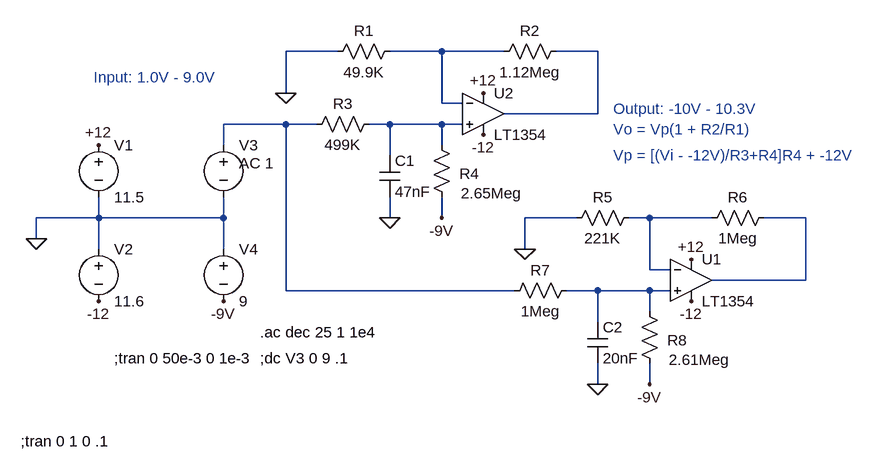
[diagram p0: schematic VCO Pickoff.asc]
VCO Pickoff.asc, the LTspice schematic file:
Version 4
SHEET 1 1120 680
WIRE 272 -112 192 -112
WIRE 432 -112 352 -112
WIRE 528 -112 432 -112
WIRE 672 -112 608 -112
WIRE 192 -48 192 -112
WIRE 432 -32 432 -112
WIRE 464 -32 432 -32
WIRE 672 -16 672 -112
WIRE 672 -16 528 -16
WIRE 192 0 96 0
WIRE 240 0 192 0
WIRE 352 0 320 0
WIRE 432 0 352 0
WIRE 464 0 432 0
WIRE 96 32 96 0
WIRE 432 32 432 0
WIRE 352 48 352 0
WIRE -96 144 -96 112
WIRE -96 144 -192 144
WIRE 96 144 96 112
WIRE 96 144 -96 144
WIRE 352 144 352 112
WIRE 432 144 432 112
WIRE 640 144 560 144
WIRE 752 144 720 144
WIRE 848 144 752 144
WIRE 992 144 928 144
WIRE -192 176 -192 144
WIRE -96 192 -96 144
WIRE 96 192 96 144
WIRE 560 192 560 144
WIRE 752 224 752 144
WIRE 784 224 752 224
WIRE 992 240 992 144
WIRE 992 240 848 240
WIRE 192 256 192 0
WIRE 544 256 192 256
WIRE 672 256 624 256
WIRE 752 256 672 256
WIRE 784 256 752 256
WIRE 752 288 752 256
WIRE 672 304 672 256
WIRE 672 400 672 368
WIRE 752 400 752 368
FLAG -192 176 0
FLAG -96 32 +12
FLAG -96 272 -12
FLAG 192 -48 0
FLAG 496 -48 +12
FLAG 496 16 -12
FLAG 96 272 -9V
FLAG 432 144 -9V
FLAG 560 192 0
FLAG 816 208 +12
FLAG 816 272 -12
FLAG 752 400 -9V
FLAG 352 144 0
FLAG 672 400 0
SYMBOL voltage -96 16 R0
WINDOW 123 0 0 Left 0
WINDOW 39 0 0 Left 0
SYMATTR InstName V1
SYMATTR Value 11.5
SYMBOL voltage -96 176 R0
WINDOW 123 0 0 Left 0
WINDOW 39 0 0 Left 0
SYMATTR InstName V2
SYMATTR Value 11.6
SYMBOL res 368 -128 R90
WINDOW 0 0 56 VBottom 2
WINDOW 3 32 56 VTop 2
SYMATTR InstName R1
SYMATTR Value 49.9K
SYMBOL res 624 -128 R90
WINDOW 0 0 56 VBottom 2
WINDOW 3 32 56 VTop 2
SYMATTR InstName R2
SYMATTR Value 1.12Meg
SYMBOL voltage 96 16 R0
WINDOW 3 -105 105 Invisible 2
WINDOW 123 24 44 Left 2
SYMATTR Value PULSE(2 2.5 0 1e-5 1e-5 250e-6 10e-3)
SYMATTR Value2 AC 1
SYMATTR SpiceLine Rser=0
SYMATTR InstName V3
SYMBOL res 336 -16 R90
WINDOW 0 0 56 VBottom 2
WINDOW 3 32 56 VTop 2
SYMATTR InstName R3
SYMATTR Value 499K
SYMBOL res 448 128 R180
WINDOW 0 -42 52 Left 2
WINDOW 3 -108 22 Left 2
SYMATTR InstName R4
SYMATTR Value 2.65Meg
SYMBOL OpAmps\\LT1354 496 -80 R0
SYMATTR InstName U2
SYMBOL voltage 96 176 R0
WINDOW 123 0 0 Left 0
WINDOW 39 0 0 Left 0
SYMATTR InstName V4
SYMATTR Value 9
SYMBOL res 736 128 R90
WINDOW 0 0 56 VBottom 2
WINDOW 3 32 56 VTop 2
SYMATTR InstName R5
SYMATTR Value 221K
SYMBOL res 944 128 R90
WINDOW 0 0 56 VBottom 2
WINDOW 3 32 56 VTop 2
SYMATTR InstName R6
SYMATTR Value 1Meg
SYMBOL res 640 240 R90
WINDOW 0 0 56 VBottom 2
WINDOW 3 32 56 VTop 2
SYMATTR InstName R7
SYMATTR Value 1Meg
SYMBOL res 768 384 R180
WINDOW 0 -42 52 Left 2
WINDOW 3 -108 22 Left 2
SYMATTR InstName R8
SYMATTR Value 2.61Meg
SYMBOL OpAmps\\LT1354 816 176 R0
SYMATTR InstName U1
SYMBOL cap 336 48 R0
SYMATTR InstName C1
SYMATTR Value 47nF
SYMBOL cap 656 304 R0
SYMATTR InstName C2
SYMATTR Value 20nF
TEXT -72 360 Left 2 !;tran 0 50e-3 0 1e-3
TEXT -104 -72 Left 2 ;Input: 1.0V - 9.0V
TEXT 696 -24 Left 2 ;Output: -10V - 10.3V
TEXT 696 8 Left 2 ;Vo = Vp(1 + R2/R1)
TEXT 696 48 Left 2 ;Vp = [(Vi - -12V)/R3+R4]R4 + -12V
TEXT 152 360 Left 2 !;dc V3 0 9 .1
TEXT 152 320 Left 2 !.ac dec 25 1 1e4
TEXT -216 488 Left 2 !;tran 0 1 0 .1

The netlist it stands for:
* VCO Pickoff.asc
V1 +12 0 11.5
V2 0 -12 11.6
R1 N001 0 49.9K
R2 N002 N001 1.12Meg
V3 N003 0 PULSE(2 2.5 0 1e-5 1e-5 250e-6 10e-3) AC 1 Rser=0
R3 N004 N003 499K
R4 -9V N004 2.65Meg
XU2 N004 N001 +12 -12 N002 LT1354  ; pins In+ In- V+ V- OUT
V4 0 -9V 9
R5 N005 0 221K
R6 N006 N005 1Meg
R7 N007 N003 1Meg
R8 -9V N007 2.61Meg
XU1 N007 N005 +12 -12 N006 LT1354  ; pins In+ In- V+ V- OUT
C1 N004 0 47nF
C2 N007 0 20nF
;tran 0 50e-3 0 1e-3
* Input: 1.0V - 9.0V
* Output: -10V - 10.3V
* Vo = Vp(1 + R2/R1)
* Vp = [(Vi - -12V)/R3+R4]R4 + -12V
;dc V3 0 9 .1
.ac dec 25 1 1e4
;tran 0 1 0 .1
.backanno
.end